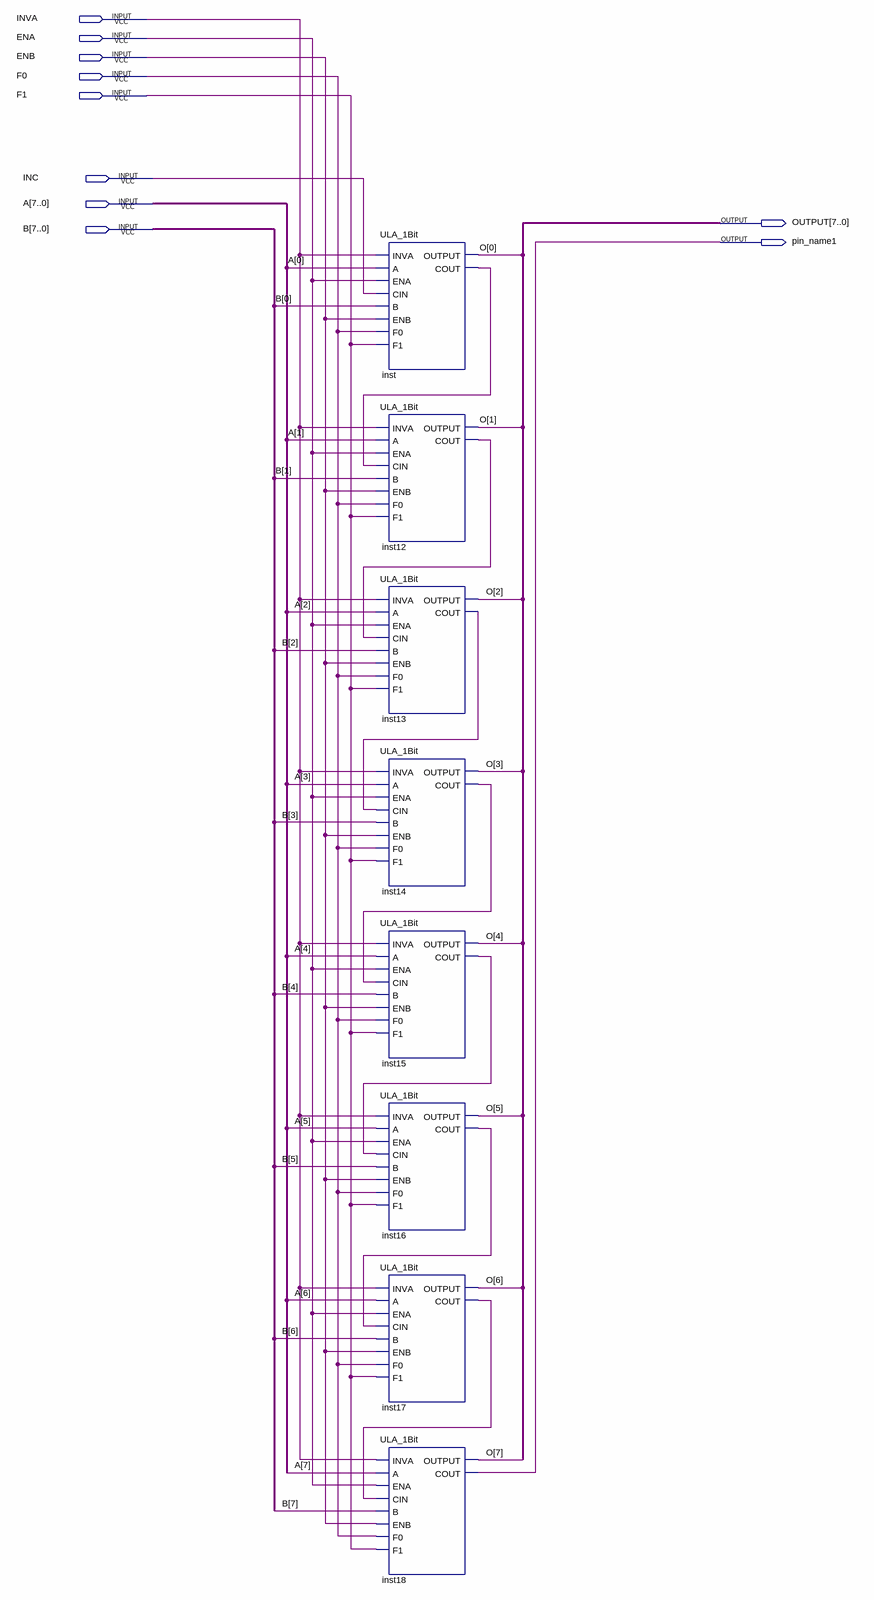
[diagram p0: schematic sheet]
// Quartus schematic ULA_8Bit.bdf as structural Verilog: 8 symbols, 10 pins
module ULA_8Bit (
  input  INVA,
  input  ENA,
  input  ENB,
  input  F0,
  input  F1,
  input  INC,
  input  [7:0] A,
  input  [7:0] B,
  output [7:0] OUTPUT,
  output pin_name1
);

  wire inst12_cout, inst13_cout, inst14_cout, inst15_cout, inst16_cout, inst17_cout, inst_cout;
  wire [7:0] O;

  ULA_1Bit inst (
    .INVA(INVA), .A(A[0]), .ENA(ENA), .CIN(INC), .B(B[0]), .ENB(ENB), .F0(F0), .F1(F1), .OUTPUT(O[0]),
    .COUT(inst_cout));
  ULA_1Bit inst12 (
    .INVA(INVA), .A(A[1]), .ENA(ENA), .CIN(inst_cout), .B(B[1]), .ENB(ENB), .F0(F0), .F1(F1), .OUTPUT(O[1]),
    .COUT(inst12_cout));
  ULA_1Bit inst13 (
    .INVA(INVA), .A(A[2]), .ENA(ENA), .CIN(inst12_cout), .B(B[2]), .ENB(ENB), .F0(F0), .F1(F1),
    .OUTPUT(O[2]), .COUT(inst13_cout));
  ULA_1Bit inst14 (
    .INVA(INVA), .A(A[3]), .ENA(ENA), .CIN(inst13_cout), .B(B[3]), .ENB(ENB), .F0(F0), .F1(F1),
    .OUTPUT(O[3]), .COUT(inst14_cout));
  ULA_1Bit inst15 (
    .INVA(INVA), .A(A[4]), .ENA(ENA), .CIN(inst14_cout), .B(B[4]), .ENB(ENB), .F0(F0), .F1(F1),
    .OUTPUT(O[4]), .COUT(inst15_cout));
  ULA_1Bit inst16 (
    .INVA(INVA), .A(A[5]), .ENA(ENA), .CIN(inst15_cout), .B(B[5]), .ENB(ENB), .F0(F0), .F1(F1),
    .OUTPUT(O[5]), .COUT(inst16_cout));
  ULA_1Bit inst17 (
    .INVA(INVA), .A(A[6]), .ENA(ENA), .CIN(inst16_cout), .B(B[6]), .ENB(ENB), .F0(F0), .F1(F1),
    .OUTPUT(O[6]), .COUT(inst17_cout));
  ULA_1Bit inst18 (
    .INVA(INVA), .A(A[7]), .ENA(ENA), .CIN(inst17_cout), .B(B[7]), .ENB(ENB), .F0(F0), .F1(F1),
    .OUTPUT(O[7]), .COUT(pin_name1));
endmodule
